# Altium schematic sheet Voltage Regulators Backup.SchDoc: Voltage Regulation
size A4; Author: Khoi Ly; DrawnBy: Khoi Ly; Organization: University of Colorado; Address1: 1111 Engineering Drive; Address2: Boulder; Address3: CO, 870309; Address4: USA; DocumentNumber: 1; Revision: 1; SheetNumber: 3; SheetTotal: 4; DocumentName: Voltage Regulators.SchDoc
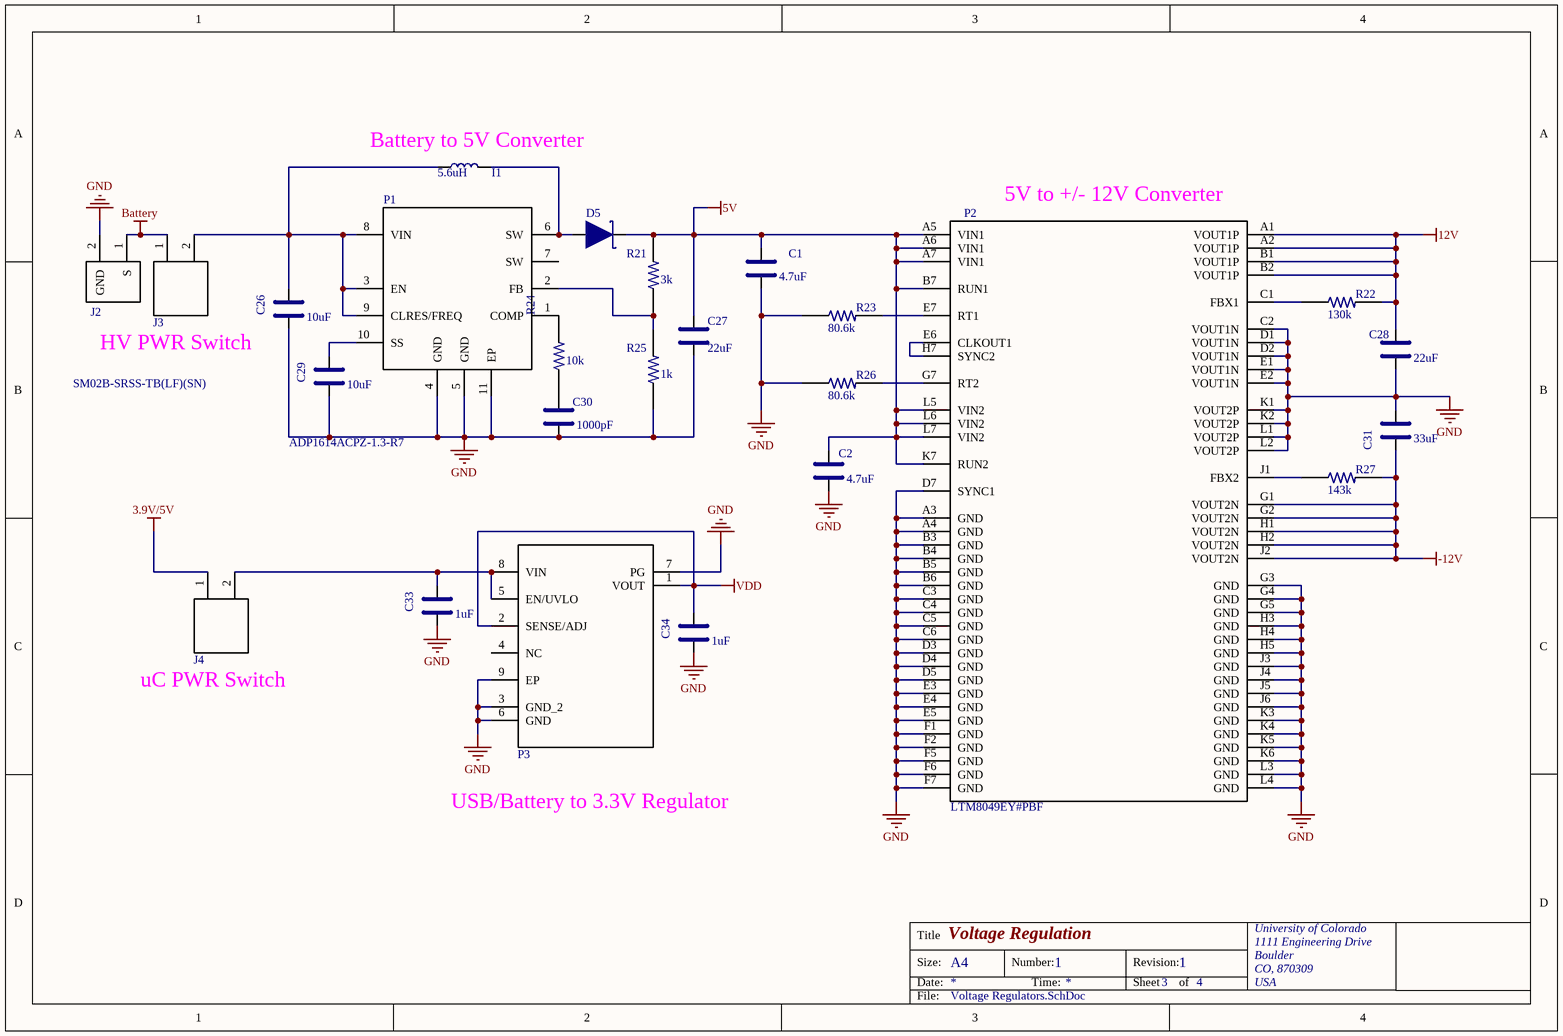
[diagram p0: Voltage Regulators Backup.SchDoc]

## Parts
C1  value 4.7uF  [C0402C102K9RACTU]  (hidden comment: GRM155R60J475)
C2  value 4.7uF  [C0402C102K9RACTU]  (hidden comment: GRM155R60J475)
C26  value 10uF  [GRM155R60J106ME47D]  (hidden comment: GRM155R60J106ME47D)
C27  value 22uF  [CC0603MRX5R6BB226]  (hidden comment: CC0603MRX5R6BB226)
C28  value 22uF  [CL21A226MAQNNNE]  (hidden comment: CL21A226MAQNNNE)
C29  value 10uF  [GRM155R60J106ME47D]  (hidden comment: GRM155R60J106ME47D)
C30  value 1000pF  [C0402C102K9RACTU]  (hidden comment: C0402C102K9RACTU)
C31  value 33uF  [GRM31CR61E476ME44L]  (hidden comment: GRM31CR61E476ME44L)
C33  value 1uF  [GRM033R60J105MEA2D]  (hidden comment: GRM033R60J105MEA2D)
C34  value 1uF  [GRM033R60J105MEA2D]  (hidden comment: GRM033R60J105MEA2D)
D5  CDBA540-HF  [CDBA540-HF]  (value not drawn)
I1  value 5.6uH  [SRP6060FA-5R6M]  (hidden comment: SRP6060FA-5R6M)
J2  SM02B-SRSS-TB(LF)(SN)  [SM02B-SRSS-TB(LF)(SN)]
J3  BM02B-SRSS-TBT  [BM02B-SRSS-TBT]  (value not drawn)
J4  BM02B-SRSS-TBT  [BM02B-SRSS-TBT]  (value not drawn)
P1  ADP1614ACPZ-1.3-R7  [ADP1614ACPZ-1.3-R7]
P2  LTM8049EY#PBF  [LTM8049EY#PBF]
P3  ADP7104ACPZ-3.3-R7  [ADP7104ARDZ-3.3]  (value not drawn)
R21  value 3k  [RC0603F202CS]  (hidden comment: RC0603F202CS)
R22  value 130k  [RC0201FR-07130KL]  (hidden comment: RC0201FR-07130KL)
R23  value 80.6k  [RC0201FR-0780K6L]  (hidden comment: RC0201FR-0780K6L)
R24  value 10k  [RC0603F103CS]  (hidden comment: RC0603F103CS)
R25  value 1k  [RC0603F202CS]  (hidden comment: RC0603F202CS)
R26  value 80.6k  [RC0201FR-0780K6L]  (hidden comment: RC0201FR-0780K6L)
R27  value 143k  [RC0201FR-07143KL]  (hidden comment: RC0201FR-07143KL)

## Nets
3.9V/5V: J4.1
5V: C1.1 C2.1 C27.1 D5.1 P2.A5(VIN1) P2.A6(VIN1) P2.A7(VIN1) P2.B7(RUN1) P2.K7(RUN2) P2.L5(VIN2) P2.L6(VIN2) P2.L7(VIN2) R21.1
12V: C28.1 P2.A1(VOUT1P) P2.A2(VOUT1P) P2.B1(VOUT1P) P2.B2(VOUT1P) R22.1
-12V: C31.2 P2.G1(VOUT2N) P2.G2(VOUT2N) P2.H1(VOUT2N) P2.H2(VOUT2N) P2.J2(VOUT2N) R27.1
Battery: J2.1(S) J3.1
GND: C1.2 C2.2 C26.2 C27.2 C28.2 C29.2 C30.2 C31.1 C33.2 C34.2 J2.2(GND) P1.4(GND) P1.5(GND) P1.11(EP) P2.A3(GND) P2.A4(GND) P2.B3(GND) P2.B4(GND) P2.B5(GND) P2.B6(GND) P2.C2(VOUT1N) P2.C3(GND) P2.C4(GND) P2.C5(GND) P2.C6(GND) P2.D1(VOUT1N) P2.D2(VOUT1N) P2.D3(GND) P2.D4(GND) P2.D5(GND) P2.D7(SYNC1) P2.E1(VOUT1N) P2.E2(VOUT1N) P2.E3(GND) P2.E4(GND) P2.E5(GND) P2.F1(GND) P2.F2(GND) P2.F5(GND) P2.F6(GND) P2.F7(GND) P2.G3(GND) P2.G4(GND) P2.G5(GND) P2.H3(GND) P2.H4(GND) P2.H5(GND) P2.J3(GND) P2.J4(GND) P2.J5(GND) P2.J6(GND) P2.K1(VOUT2P) P2.K2(VOUT2P) P2.K3(GND) P2.K4(GND) P2.K5(GND) P2.K6(GND) P2.L1(VOUT2P) P2.L2(VOUT2P) P2.L3(GND) P2.L4(GND) P3.3(GND_2) P3.6(GND) P3.7(PG) P3.9(EP) R23.2 R25.2 R26.2
VDD: C34.1 P3.1(VOUT) P3.2(SENSE/ADJ)
NetC26_1: C26.1 I1.1 J3.2 P1.3(EN) P1.8(VIN) P1.9(CLRES/FREQ)
NetC29_1: C29.1 P1.10(SS)
NetC30_1: C30.1 R24.2
NetC33_1: C33.1 J4.2 P3.5(EN/UVLO) P3.8(VIN)
NetD5_2: D5.2 I1.2 P1.6(SW)
NetP1_1: P1.1(COMP) R24.1
NetP1_2: P1.2(FB) R21.2 R25.1
NetP2_C1: P2.C1(FBX1) R22.2
NetP2_E6: P2.E6(CLKOUT1) P2.H7(SYNC2)
NetP2_E7: P2.E7(RT1) R23.1
NetP2_G7: P2.G7(RT2) R26.1
NetP2_J1: P2.J1(FBX2) R27.2

Not connected (* = marked no-connect by the designer): P1 7(SW); P3 4(NC)

## Notes on the sheet
- (near I1) Battery to 5V Converter
- (near P2) 5V to +/- 12V Converter
- HV PWR Switch
- uC PWR Switch
- USB/Battery to 3.3V Regulator
- Title
- Size:
- Date:
- A4
- Number:
- Time:
- Revision:
- Sheet
- of
- File:

## Library data of the parts
C1 C2 = GRM155R60J475: CAP CER 4.7UF 6.3V X5R 0402; Manufacturer: Murata; Manufacturer Part Number: GRM155R60J475ME47D‎; Package: 0402; Digikey Part Number: ‎490-5915-1-ND‎; Voltage Rated: 6.3V; Temperature Coefficient: X5R; Unit Price: $0.55; Supplier: Digikey
C26 C29 = GRM155R60J106ME47D: CAP CER 10UF 6.3V X5R 0402; Manufacturer: Murata; Package: 0402 (1005 Metric); Manufacturer Part Number: GRM155R60J106ME47D; Digikey Part Number: 490-13239-1-ND; Voltage Rated: 6.3V; Temperature Coefficient: X5R; Unit Price: $0.85; Supplier: Digikey
C27 = CC0603MRX5R6BB226: CAP CER 22UF 10V X5R 0603; Manufacturer: Yageo; Package: 0603 (1608 Metric); Manufacturer Part Number: CC0603MRX5R6BB226; Digikey Part Number: 311-1819-1-ND; Voltage Rated: 10V; Temperature Coefficient: X5R; Unit Price: $0.77; Supplier: Digikey
C28 = CL21A226MAQNNNE: CAP CER 22UF 25V X5R 0805; Manufacturer: Samsung; Package: 0603 (1608 Metric); Manufacturer Part Number: CL21A226MAQNNNE; Digikey Part Number: 1276-2908-1-ND; Voltage Rated: 25V; Temperature Coefficient: X5R; Unit Price: $0.75; Supplier: Digikey
C30 = C0402C102K9RACTU: CAP CER 1000PF 6.3V X7R 0402; Manufacturer: Murata; Manufacturer Part Number: GRM155R60J106ME47D; Package: 0402 (1005 Metric); Digikey Part Number: 399-8941-6-ND; Voltage Rated: 6.3V; Temperature Coefficient: X7R; Unit Price: $0.1; Supplier: Digikey
C31 = C3216JB1E336M160AC: CAP CER 33UF 25V JB 1206; Manufacturer: TDK Corporation; Temperature Coefficient: X5R; Package: 1206 (3216 Metric); Manufacturer Part Number: C3216JB1E336M160AC; Digikey Part Number: 445-11710-1-ND; Voltage Rated: 25V; Unit Price: $0.75; Supplier: Digikey
C33 C34 = GRM033R60J105MEA2D: CAP CER 1UF 6.3V X5R 0201; Manufacturer: Murata; Package: 0201 (0603 Metric); Manufacturer Part Number: GRM033R60J105MEA2D; Digikey Part Number: 490-7229-1-ND; Voltage Rated: 6.3V; Temperature Coefficient: X5R; Unit Price: $0.15; Supplier: Digikey
D5 = CDBA540-HF: Manufacturer: Comchip Technology; DC Reverse: 40V; Forward Voltage: 550mV @ 5A; Package: DO-214AC; Manufacturer Part Number: CDBA540-HF; Digikey Part Number: 641-1707-1-ND; Unit Price: $0.49; Supplier: Digikey
I1 = SRP6060FA-5R6M: IND,6.6X6.4X5.8MM,5.6UH,20%,10A; Manufacturer: Bourns; Package: Non Standard; Manufacturer Part Number: SRP6060FA-5R6M; Digikey Part Number: SRP6060FA-5R6MCT-ND; Current Rating: 10A; Unit Price: $1.6; Supplier: Digikey
J2 = SM02B-SRSS-TB(LF)(SN): SH Series 2 Position 1 mm Pitch Surface Mount Side Entry Shrouded Header; MP: SM02B-SRSS-TB_LF__SN_; MF: JST; SnapEDA_Link: https://www.snapeda.com/parts/SM02B-SRSS-TB%28LF%29%28SN%29/JST%20Sales%20America%20Inc/view-part/?ref=snap; Package: None; Price: 0.24 USD; Availability: Good; Value: *
J3 J4 = BM02B-SRSS-TBT: CONN WIRE HDR 2POS 1MM STSMD; Manufacturer: JST; Digikey Part Number: 455-2955-1-ND; Unit Price: $7.85; Manufacturer Part Number: BM02B-SRSS-TBT
P1 = ADP1614ACPZ-1.3-R7: IC REG BOOST ADJ 4A 10LFCSP; Manufacturer: Analog Devices; Voltage Output: 2.5V-20V; Voltage Input: 2.5-5.5V; Current Output: 4A (switch); Manufacturer Part Number: ADP1614ACPZ-1.3-R7; Digikey Part Number: ADP1614ACPZ-1.3-R7CT-ND; Package: 10-LFCSP_WD; Unit Price: $2.89
P2 = LTM8049EY#PBF: DC DC CONVERTER +/-2.5 TO +/-24V; Manufacturer: Linear Technology; Digikey Part Number: LTM8049EY#PBF-ND; Manufacturer Part Number: LTM8049EY#PBF; Unit Price: $24.75; Package / Case: 77-BBGA
P3 = ADP7104ACPZ-3.3-R7: IC REG LINEAR 3.3V 500MA 8LFCSP; Manufacturer: Analog Devices; Voltage Output: 3.3V (fixed); Voltage Input: 20V (max); Manufacturer Part Number: ADP7104ACPZ-3.3-R7; Digikey Part Number: ADP7104ACPZ-3.3-R7DKR-ND; Current Output: 500mA; Package: 8-LFCSP_WD; Unit Price: $4.5
R21 = RMCF0201FT3K00: RES 3K OHM 1% 1/20W 0201; Manufacturer: Stackpole; Power (Watts): 0.05W; Package: 0201 (0603 Metric); Manufacturer Part Number: RMCF0201FT3K00; Digikey Part Number: RMCF0201FT3K00CT-ND; Unit Price: 0.1; Supplier: Digikey
R22 = RC0201FR-07130KL: RES SMD 130K OHM 1% 1/20W 0201; Manufacturer: Yageo; Power (Watts): 0.05W; Package: 0201 (0603 Metric); Manufacturer Part Number: RC0201FR-07130KL; Digikey Part Number: YAG2393DKR-ND; Unit Price: 0.1; Supplier: Digikey
R23 R26 = RC0201FR-0780K6L: RES SMD 80.6K OHM 1% 1/20W 0201; Manufacturer: Yageo; Power (Watts): 0.05W; Package: 0201 (0603 Metric); Manufacturer Part Number: RC0201FR-0780K6L; Digikey Part Number: YAG2810DKR-ND; Unit Price: 0.1; Supplier: Digikey
R24 = RC0603F103CS: RES SMD 10K OHM 1% 1/20W 0201; Manufacturer: Samsung; Power (Watts): 0.05W; Package: 0201 (0603 Metric); Manufacturer Part Number: RC0603F103CS; Digikey Part Number: YAG2407CT-ND; Unit Price: 0.1; Supplier: Digikey
R25 = RC0201FR-071KL: RES SMD 1K OHM 1% 1/20W 0201; Manufacturer: Yageo; Power (Watts): 0.05W; Package: 0201 (0603 Metric); Manufacturer Part Number: RC0201FR-071KL; Digikey Part Number: 311-1KMCT-ND; Unit Price: 0.1; Supplier: Digikey
R27 = RC0201FR-07143KL: RES SMD 143K OHM 1% 1/20W 0201; Manufacturer: Yageo; Power (Watts): 0.05W; Package: 0201 (0603 Metric); Manufacturer Part Number: RC0201FR-07143KL; Digikey Part Number: YAG2407CT-ND; Unit Price: 0.1; Supplier: Digikey